# Altium schematic sheet nrf24L01P.SchDoc: MJVESC - NRF24L01P
size A4; Author: Dongil Choi; Organization: DRC LAB, Myongji University; Address1: Engineering Building 1, #214; Address2: 116 Myongji-ro, Cheoin-Gu; Address3: Yongin-si, Gyeonggi-Do; Address4: South Korea, 17058; DocumentNumber: 4; Revision: 0.2; SheetNumber: 4; SheetTotal: 5
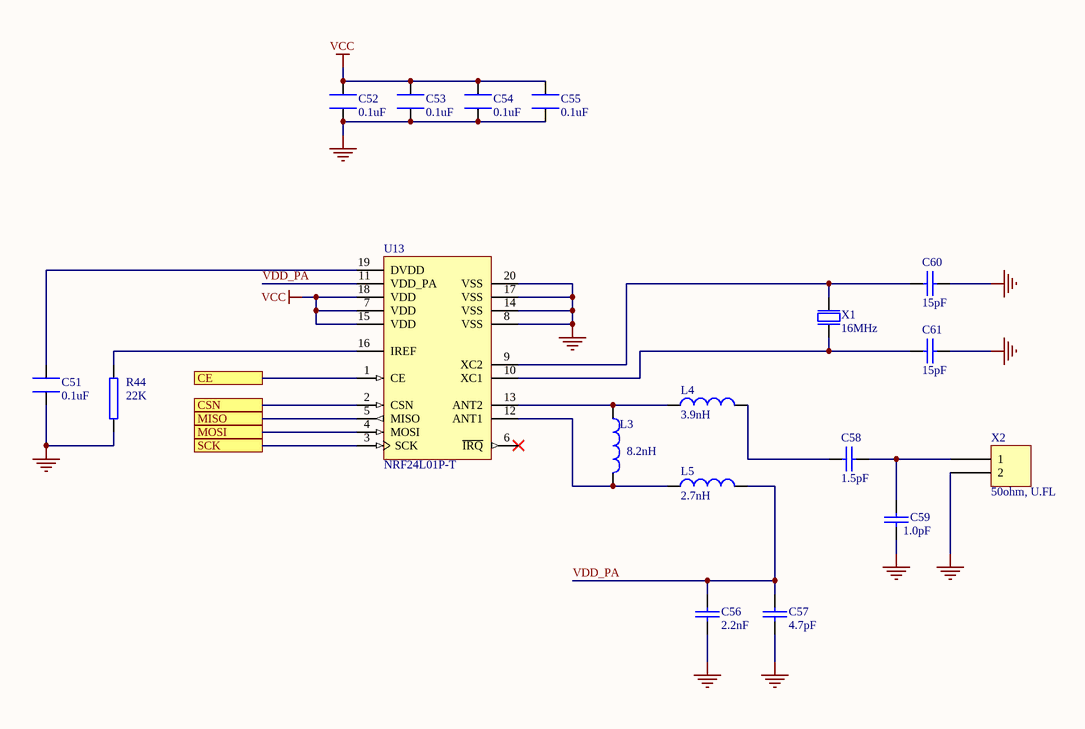
[diagram p0: nrf24L01P.SchDoc]

## Parts
C51  0.1uF  [CAP 0603/1608]
C52  0.1uF  [CAP 0603/1608]
C53  0.1uF  [CAP 0603/1608]
C54  0.1uF  [CAP 0603/1608]
C55  0.1uF  [CAP 0603/1608]
C56  2.2nF  [CAP 0402/1005]
C57  4.7pF  [CAP 0402/1005]
C58  1.5pF  [CAP 0402/1005]
C59  1.0pF  [CAP 0402/1005]
C60  15pF  [CAP 0402/1005]
C61  15pF  [CAP 0402/1005]
L3  8.2nH  [0402-A]
L4  3.9nH  [0402-A]
L5  2.7nH  [0402-A]
R44  22K  [RES 0402/1005]
U13  NRF24L01P-T  [NRSC-QFN-20_L]
X1  16MHz  [BT-XTAL_2520]
X2  50ohm, U.FL  [uFL_SMT]

## Ports
CE, CSN, MISO, MOSI, SCK

## Nets
GND: C51.2 C52.1 C53.2 C54.2 C55.2 C56.1 C57.1 C59.2 C60.2 C61.2 R44.1 U13.8(VSS) U13.14(VSS) U13.17(VSS) U13.20(VSS) X1.2(GND) X1.4(GND) X2.2
VCC: C52.2 C53.1 C54.1 C55.1 U13.7(VDD) U13.15(VDD) U13.18(VDD)
CE: U13.1(CE) ; port CE
CSN: U13.2(CSN) ; port CSN
MISO: U13.5(MISO) ; port MISO
MOSI: U13.4(MOSI) ; port MOSI
SCK: U13.3(SCK) ; port SCK
VDD_PA: C56.2 C57.2 L5.2 U13.11(VDD_PA)
NetC51_1: C51.1 U13.19(DVDD)
NetC58_1: C58.1 C59.1 X2.1
NetC58_2: C58.2 L4.2
NetC60_1: C60.1 U13.9(XC2) X1.1(inp)
NetC61_1: C61.1 U13.10(XC1) X1.3(out)
NetL3_1: L3.1 L4.1 U13.13(ANT2)
NetL3_2: L3.2 L5.1 U13.12(ANT1)
NetR44_2: R44.2 U13.16(IREF)

Not connected (* = marked no-connect by the designer): U13 6(~{IRQ})*

## Notes on the sheet
- Title
- Size:
- Date:
- A4
- Number:
- Time:
- Revision:
- Sheet
- Author:
- of
- File:

## Library data of the parts
C51-C55 = GRM188R71E104KA01D: CAP CER 0.1UF 25V X7R 0603; PartNumber: GRM188R71E104KA01D
C56 = CAP: CAP CER 2.2nF 50V NP0 0402; PartNumber: GRM155R71H222KA01D
C57 = CAP: CAP CER 4.7pF 50V NP0 0402; PartNumber: GRM1555C1H4R7CA01D
C58 = CAP: CAP CER 1.5pF 50V NP0 0402; PartNumber: GRM1555C1H1R5CA01D
C59 = CAP: CAP CER 1.0pF 50V NP0 0402; PartNumber: GRM1555C1H1R0CA01D
C60 C61 = CAP: CAP CER 15PF 50V NP0 0402; PartNumber: GRM1555C1H150GA01D
L3 = Inductor: Fixed Inductors 0402 8.2nH 0.24ohms 550mA +/-5%; PartNumber: LQG15HZ8N2J02D
L4 = Inductor: Fixed Inductors 0402 3.9nH 0.2nH 750mA .14ohms 6.0GHz; PartNumber: LQG15HS3N9C02D
L5 = Inductor: Fixed Inductors 0402 2.7nH 0.12ohms 800mA +/-0.3nH; PartNumber: LQG15HZ2N7S02D
R44 = RES2: RES SMD 22K OHM 1% 1/10W 0402; PartNumber: RC0402FR-0722KL
U13 = CMP-2000-06859-1: Single Chip Transceiver, 2.4 GHz, 60 mW, 1.9 to 3.6 V, -40 to 85 degC, 20-Pin QFN, RoHS, Tray; Manufacturer: Nordic Semiconductor; Data Rate (Max): 2Mbps; Current - Transmitting: 7mA~11.3mA; Power - Output: 0dBm; Other Names: 1490-1019; Online Catalog: nRF24L01+; Current - Receiving: 12.6mA~13.5mA; For Use With: 1490-1002-ND-KITEVALUATIONNRF24L01P1568-1295-ND-SPARKFUNTRANSCEIVERBREAKOUT-1568-1296-ND-SPARKFUNTRANSCEIVERBREAKOUT-1471-1410-ND-DEVBOARDNRFSCLICKNRF24L01P-MODULE-PCB-ND-KITEVALNRF24L01+PCBANTENNANRF24L01P-MODULE-SMA-ND-KITEVALNRF24L01+SMACONNNRF24L01P-UPGRADE-ND-UPGRADE2PCB/1SMANRF24L01103990038-ND-DEVDUINOSENSORNODEV1.3103990053-ND-DEVDUINOSENSORNODEV2(ATMEGA103990074-ND-DEVDUINOSENSORNODE106990026-ND-ENERGYMONITORSHIELDV2113990088-ND-WIRELESSGATESHIELD113990095-ND-DEVDUINOSENSORNODEV3(ATMEGA106030001-ND-ENERGYMONITORSHIELD1597-1361-ND-DEVDUINOSENSORNODEV2.2(ATMEG105990030-ND-RGBWSTRIPWIRELESSSHIELDV1.0; Frequency: 2.4GHz; Design Resources: DevelopmentToolSelector; RF Family/Standard: GeneralISM>1GHZ; Serial Interfaces: SPI; Sensitivity: -94dBm; Voltage - Supply: 1.9V~3.6V; Modulation: GFSK; GPIO: -; Package Reference: QFN20; Memory Size: -; Category: RF/IFandRFID; Type: TxRxOnly; Standard Package: 490; Package / Case: 20-VFQFNExposedPad; Packaging: Tray; Series: -; Package Description: 20-Pin Quad Flat No-lead Package, Body 4 x 4 mm, Pitch 0.5 mm; Datasheet Version: Rev. 1.0, 09/2008; Protocol: -; Manufacturer URL: http://www.nordicsemi.com/eng/Products/; Operating Temperature: -40°C~85°C; Family: RFTransceiverICs; Datasheet URL: http://www.nordicsemi.com/eng/content/download/2726/34069/file/nRF24L01P_Product_Specification_1_0.pdf; Mounting Technology: SurfaceMount; PartNumber: NRF24L01P-T
X1 = XTAL_SMD2520_16MHz_8pF_NDK: XTAL SMD 2520, 16MHz, Cl=8pF, Total Tol: ±40ppm; PartNumber: NX2520SA-16MHZ-STD-CSW-5; Manufacturer: NDK; Manufacturer Part Number: NX2520SA/16MHz/EXS00A-CS06713; Note: XTAL SMD 16.000MHz; Artikkelnr Noca: 22019192; Artikkelnr Simpro: N.A.; Datasheet: http://www.ndk.com/images/products/catalog/c_NX2520SA-STD-CSW-5_e.pdf; LatestRevisionDate: 2014-11-27; Pin Count: 4; Publisher: Nordic Semiconductor; Published: 2012-06-15; Value: 16MHz; Supplier: Digi-Key; Supplier part number: 644-1169-1-ND; 2nd source Supplier: *; 2nd source part number: *; Footprint Doc: XTAL_2520
X2 = 2 Pin: 50ohm U.FL Connector; PartNumber: U.FL-R-SMT(10)